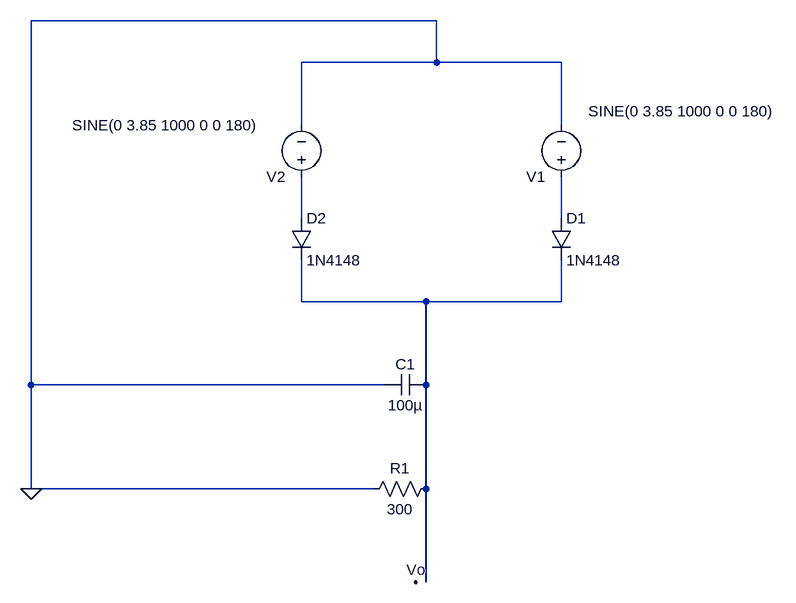
[diagram p0: schematic Project 1.asc]
Project 1.asc, the LTspice schematic file:
Version 4
SHEET 1 1068 680
WIRE 544 -1104 -80 -1104
WIRE 544 -1040 544 -1104
WIRE 544 -1040 336 -1040
WIRE 736 -1040 544 -1040
WIRE 336 -944 336 -1040
WIRE 736 -944 736 -1040
WIRE 336 -800 336 -864
WIRE 736 -800 736 -864
WIRE 336 -672 336 -736
WIRE 528 -672 336 -672
WIRE 736 -672 736 -736
WIRE 736 -672 528 -672
WIRE -80 -544 -80 -1104
WIRE 464 -544 -80 -544
WIRE 528 -544 528 -672
WIRE -80 -384 -80 -544
WIRE 448 -384 -80 -384
WIRE 528 -384 528 -544
WIRE 528 -240 528 -384
FLAG 512 -240 Vo
FLAG -80 -384 0
SYMBOL voltage 736 -848 R180
WINDOW 3 -330 117 Left 2
WINDOW 123 0 0 Left 0
WINDOW 39 0 0 Left 0
SYMATTR InstName V1
SYMATTR Value SINE(0 3.85 1000 0 0 180)
SYMBOL voltage 336 -848 R180
WINDOW 3 65 95 Left 2
WINDOW 123 0 0 Left 0
WINDOW 39 0 0 Left 0
SYMATTR InstName V2
SYMATTR Value SINE(0 3.85 1000 0 0 180)
SYMBOL cap 528 -560 R90
WINDOW 0 0 32 VBottom 2
WINDOW 3 32 32 VTop 2
SYMATTR InstName C1
SYMATTR Value 100µ
SYMBOL res 544 -400 R90
WINDOW 0 0 56 VBottom 2
WINDOW 3 32 56 VTop 2
SYMATTR InstName R1
SYMATTR Value 300
SYMBOL diode 720 -800 R0
SYMATTR InstName D1
SYMATTR Value 1N4148
SYMBOL diode 320 -800 R0
SYMATTR InstName D2
SYMATTR Value 1N4148

The netlist it stands for:
* Project 1.asc
V1 N002 0 SINE(0 3.85 1000 0 0 180)
V2 N001 0 SINE(0 3.85 1000 0 0 180)
C1 N003 0 100µ
R1 N003 0 300
D1 N002 N003 1N4148
D2 N001 N003 1N4148
.model D D
.lib standard.dio
.backanno
.end